# EAGLE design lvco-1S (EAGLE 6.4)
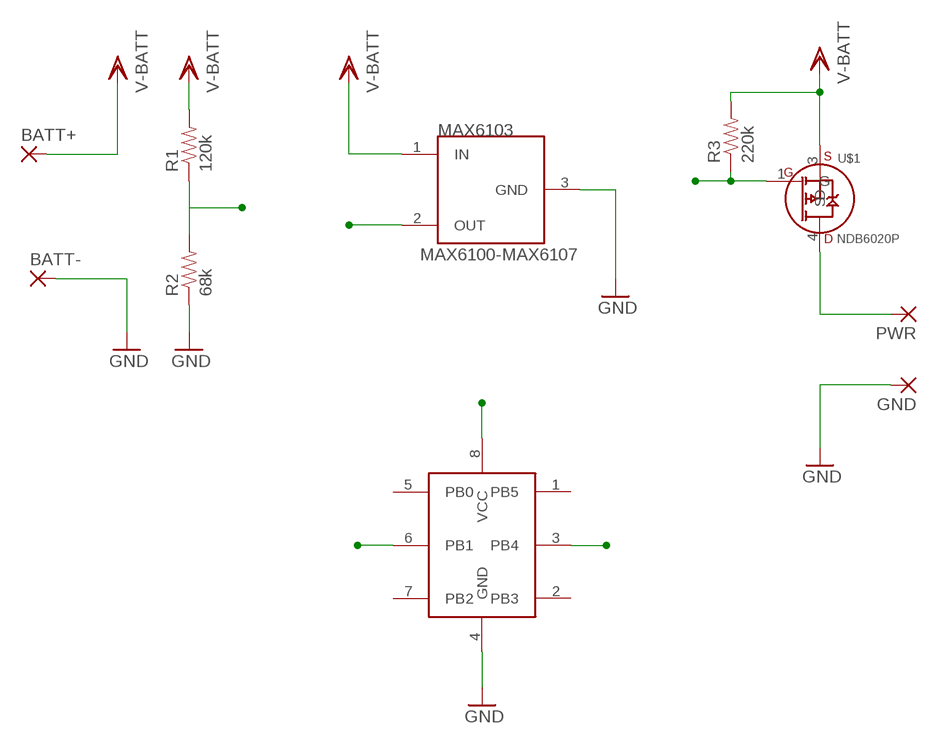
[diagram p0: schematic, sheet 1]

## Parts
BATT+  WIREPAD2,54/1,1  [2,54/1,1]
BATT-  WIREPAD2,54/1,1  [2,54/1,1]
GND  WIREPAD2,54/1,1  [2,54/1,1]
MAX6103  MAX6100-MAX6107  [SOT-23-3]
PWR  WIREPAD2,54/1,1  [2,54/1,1]
R1  120k  RESISTOR0805-RES  [0805]
R2  68k  RESISTOR0805-RES  [0805]
R3  220k  RESISTOR0805-RES  [0805]
U$1  NDB6020P  [TO-263AB]
U$2  ATTINY13  [WSOIC-8]

## Nets
GND: BATT-.1(P) GND.1(P) MAX6103.3(GND) R2.1 U$2.4(GND)
N$2: PWR.1(P) U$1.4(D)
REF-BATT: R1.1 R2.2 U$2.6(PB1)
SW: R3.1 U$1.1(G) U$2.3(PB4)
VCC: MAX6103.2(OUT) U$2.8(VCC)
VSS: BATT+.1(P) MAX6103.1(IN) R1.2 R3.2 U$1.3(S) ; supply symbol labelled V-BATT
Unconnected: U$2.1(PB5) U$2.2(PB3) U$2.5(PB0) U$2.7(PB2)

## Library data of the parts
BATT+ BATT- GND PWR = wirepad:WIREPAD: Wire PAD connect wire on PCB
MAX6103 = Synapseware:MAX6100-MAX6107
R1-R3 = SparkFun-Resistors:RESISTOR: Resistor Basic schematic elements and footprints for 0603, 1206, and PTH resistors.
U$1 = Synapseware:NDB6020P
U$2 = Synapseware:ATTINY13

## Board
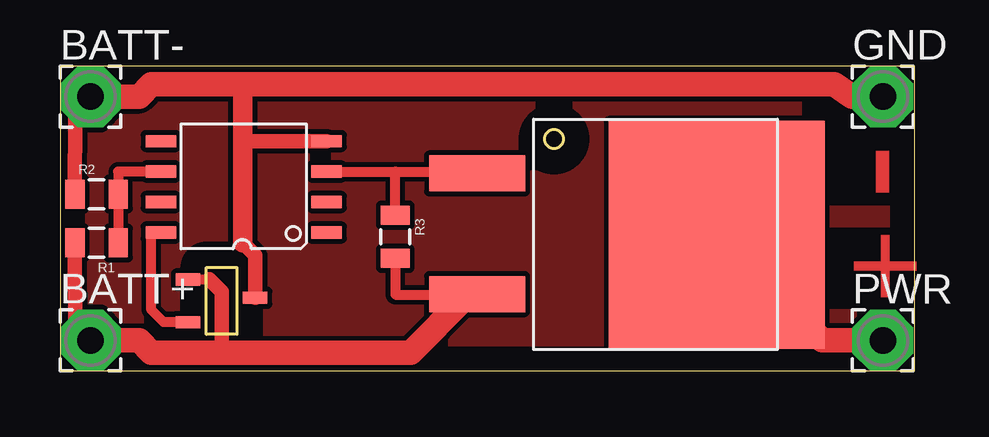
[diagram p1: board, top side]

Size 35.61 x 12.69 mm. Coordinates in mm from the lower left corner, seen from the top.
Outline: 0,0 35.61,0 35.61,12.69 0,12.69 0,0
Copper layers (1*16): Top 0.035mm / dielectric 1.5mm / Bottom 0.035mm
Design rules "default": minimum track width 10mil, minimum drill 24mil, track to track 8mil, track to pad 8mil, pad to pad 8mil, via to via 8mil, smd to smd 8mil, copper to edge 40mil, drill to drill 8mil, minimum pad ring 10mil, minimum via ring 8mil, stop-mask expansion 4mil, vias tented up to drill 0mil, thermal gap 10mil

### Footprints (pad centres in the part's own frame; a part is rotated, then mirrored left to right if it is on the bottom)
2,54/1,1 = drill 1.118 pad 2.54 octagon: 1 0,0
SOT-23-3 = smd 1.016 x 0.508: 1 -0.762,-0.508; 2 -0.762,-2.286; 3 2.032,-1.27
0805 = smd 0.8 x 1.2: 1 -0.9,0; 2 0.9,0
TO-263AB = smd 1.5 x 4: 1 -2.517,-8.652; 3 2.517,-8.652 | smd 9.5 x 9: 4 0.05,1.32
WSOIC-8 = smd 0.508 x 1.27: 1 -1.855,-3.486; 2 -0.585,-3.486; 3 0.685,-3.486; 4 1.955,-3.486; 5 1.955,3.413; 6 0.685,3.413; 7 -0.585,3.413; 8 -1.855,3.413

### Placement (x,y rotation side)
BATT+  1.27,1.27 0 top
BATT-  1.27,11.43 0 top
GND  34.29,11.43 0 top
MAX6103  6.1,4.32 0 top
PWR  34.29,1.27 0 top
R1  1.52,5.33 180 top
R2  1.52,7.37 0 top
R3  13.97,5.59 270 top
U$1  26.04,5.71 270 top
U$2  7.62,7.62 90 top

### Tracks (layer width: path | path; a pad name or v marks a point on that pad's centre or on a via)
GND
  Top 0.406: BATT-.1 0.64,10.78 | 7.62,11.81 6.99,11.94 | 7.7,9.57 7.62,9.65
  Top 0.61: 0.64,10.78 R2.1 | MAX6103.3 8.13,4.83 7.62,5.33 | U$2.4 7.7,9.57
  Top 0.813: 7.62,5.33 7.62,9.65 7.62,11.81
  Top 1.016: BATT-.1 3.3,11.43 3.81,11.94 6.99,11.94 32.26,11.94 33.02,11.43 GND.1
N$1
  pour Top: 0,0 35.56,0 35.56,12.7 0,12.7
N$2
  Top 1.016: PWR.1 31.75,1.27 U$1.4
REF-BATT
  Top 0.406: R2.2 R1.1 | 2.54,7.48 R2.2 | 2.42,7.24 R2.2 | R2.2 2.42,8.3 U$2.6
SW
  Top 0.406: U$2.3 13.97,8.3 | 13.97,8.3 17.31,8.3 U$1.1 | R3.1 13.97,8.3
VCC
  Top 0.406: MAX6103.2 4.32,2.03 3.81,2.54 3.81,5.71 U$2.8
VSS
  Top 0.406: 8.26,0.89 8.13,0.76 | R1.2 0.62,4.69 | 0.64,1.91 BATT+.1 | MAX6103.1 6.22,3.81 | R3.2 13.97,3.17 16.75,3.17 16.75,3.05 16.89,3.05 17.23,3.05 U$1.3
  Top 0.61: 0.62,4.69 0.64,1.91 | 6.22,3.81 6.73,3.3 6.73,0.76
  Top 1.016: BATT+.1 3.3,1.27 3.81,0.76 6.73,0.76 8.13,0.76 14.61,0.76 16.89,3.05

### Text on the board
Top: - | +